# EAGLE schematic TSOC-FTDI-BASE_32 (EAGLE 6.6.0)
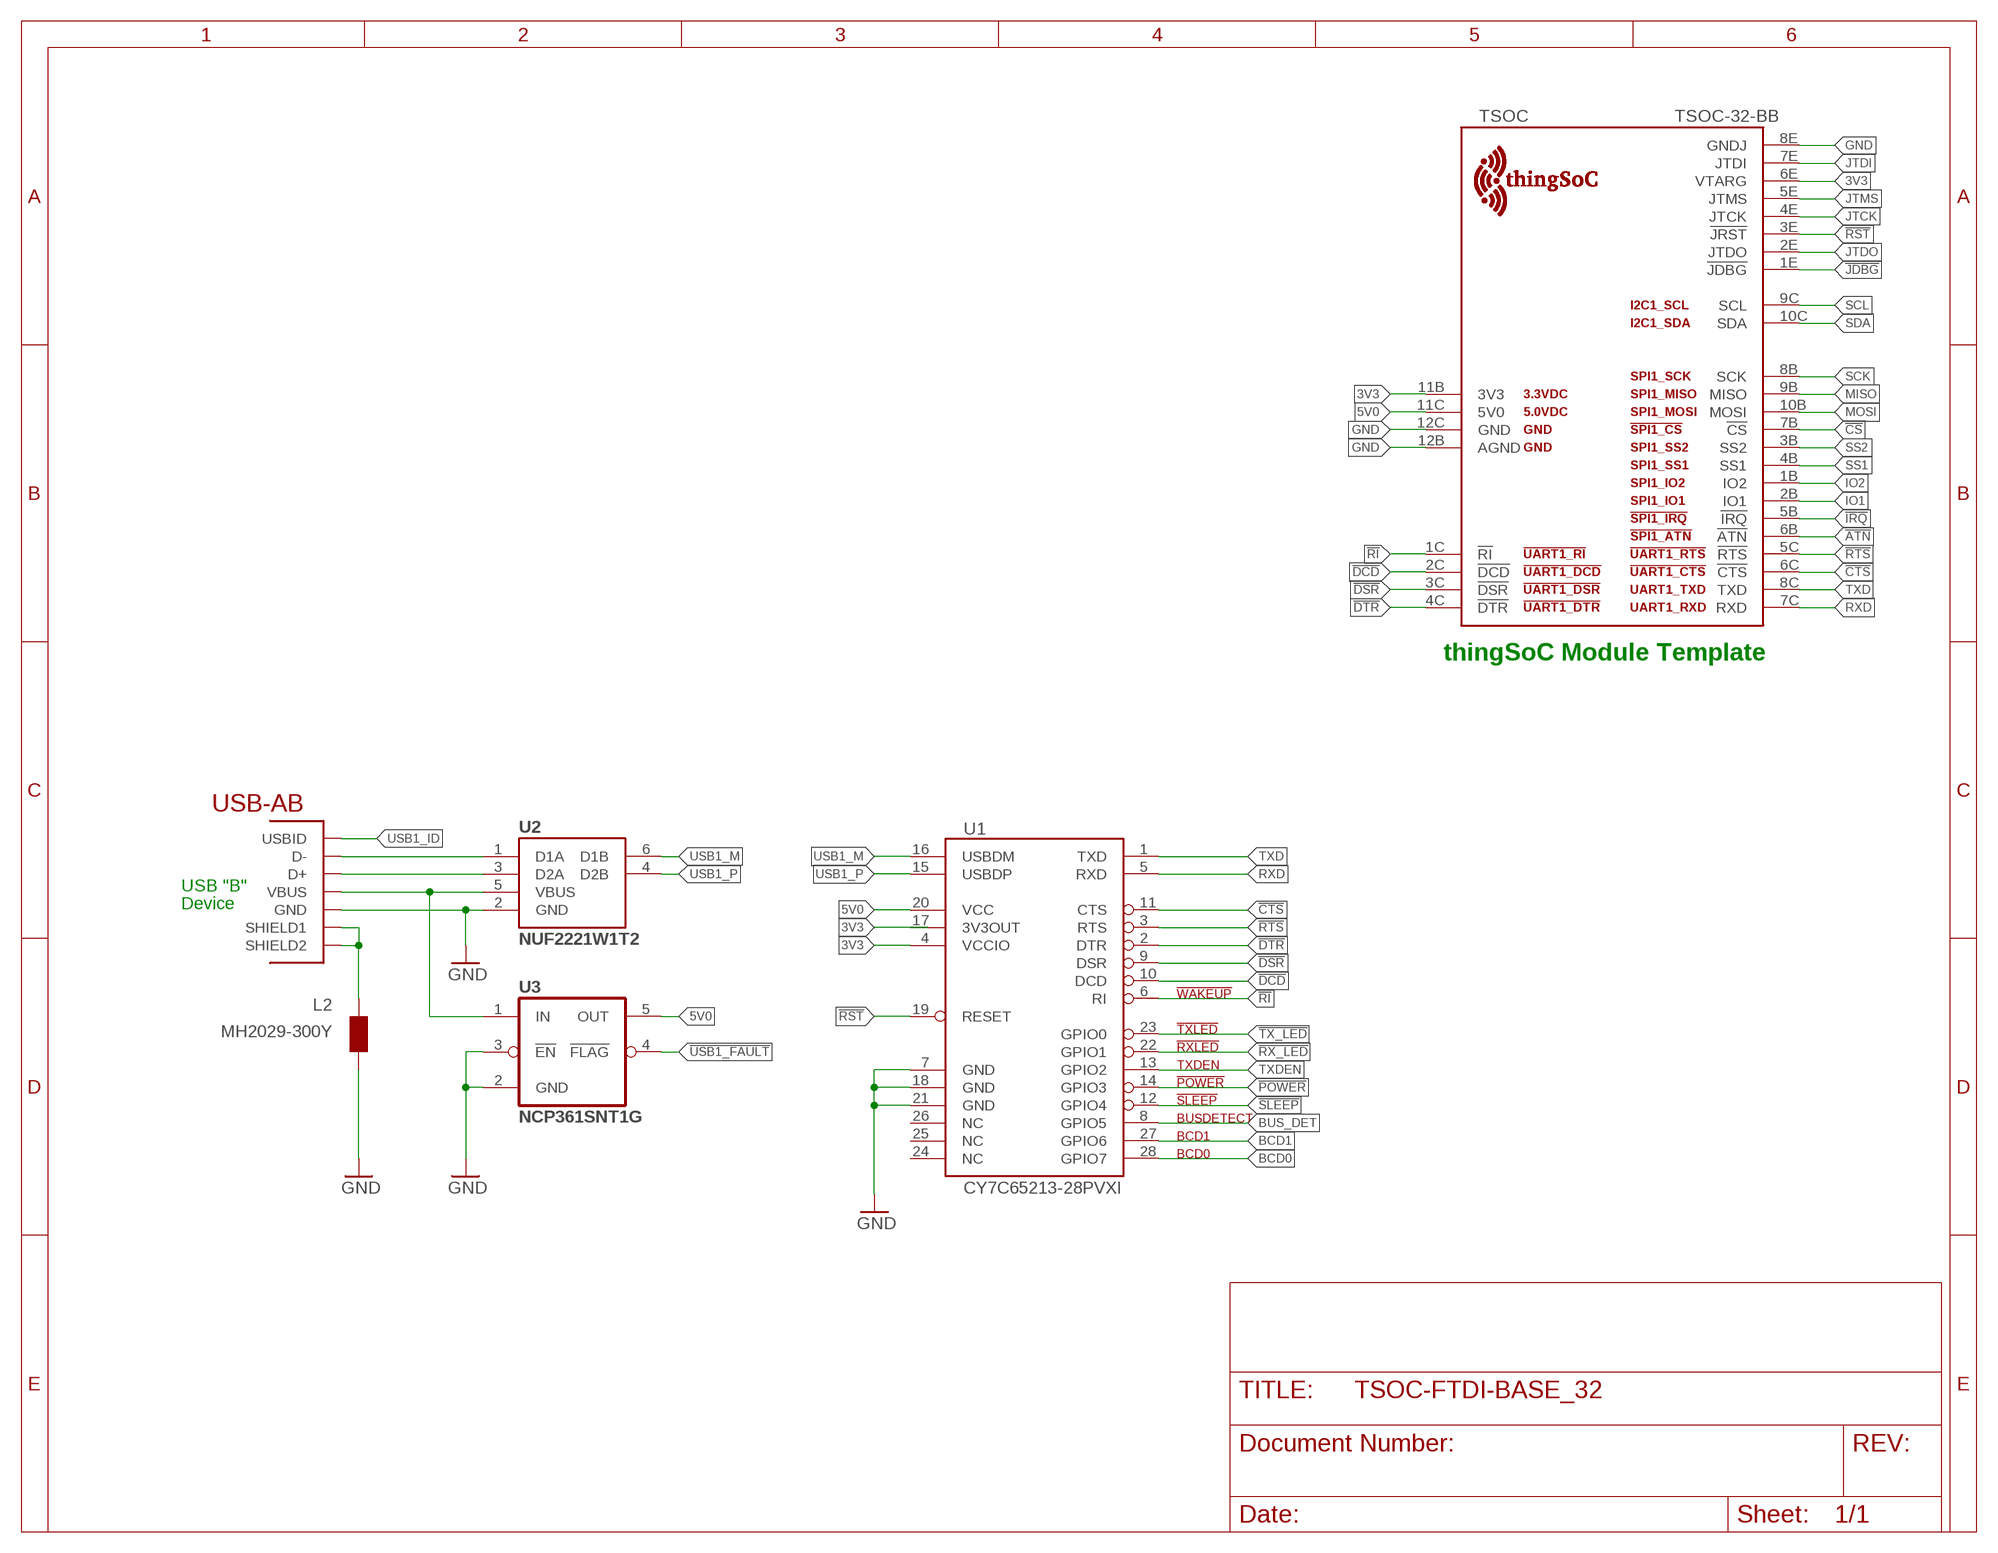
[diagram p0: schematic, sheet 1]

## Parts
L2  MH2029-300Y  WE-CBF_0805  [0805]
TSOC  TSOC-32-BB  [TSOC-BB-S32]
U1  CY7C65213-28PVXI  [SSOP28DB]
U2  NUF2221W1T2  [SOT-363]
U3  NCP361SNT1G  [SOP95P275X110-5N]
USB1  USB_AB  [USB-AB-MICRO-SMD]

## Nets
3V3: TSOC.6E(VTARG) TSOC.11B(3V3) U1.4(VCCIO)
5V0: TSOC.11C(5V0) U1.20(VCC) U3.5(OUT)
!ATN: TSOC.6B(!ATN)
!CS: TSOC.7B(!CS)
!CTS: TSOC.6C(!CTS) U1.11(CTS)
!DCD: TSOC.2C(!DCD) U1.10(DCD)
!DSR: TSOC.3C(!DSR) U1.9(DSR)
!DTR: TSOC.4C(!DTR) U1.2(DTR)
!IRQ: TSOC.5B(!IRQ)
!JDBG: TSOC.1E(!JDBG)
!POWER: U1.14(GPIO3)
!RI: TSOC.1C(!RI) U1.6(RI)
!RST: TSOC.3E(!JRST) U1.19(RESET)
!RTS: TSOC.5C(!RTS) U1.3(RTS)
!RX_LED: U1.22(GPIO1)
!SLEEP: U1.12(GPIO4)
!TX_LED: U1.23(GPIO0)
!USB1_FAULT: U3.4(!FLAG)
BCD0: U1.28(GPIO7)
BCD1: U1.27(GPIO6)
BUS_DET: U1.8(GPIO5)
GND [vcc]: L2.2 TSOC.8E(GNDJ) TSOC.12B(AGND) TSOC.12C(GND) U1.7(GND) U1.18(GND) U1.21(GND) U2.2(GND) U3.2(GND) U3.3(!EN) USB1.GND
IO1: TSOC.2B(IO1)
IO2: TSOC.1B(IO2)
JTCK: TSOC.4E(JTCK)
JTDI: TSOC.7E(JTDI)
JTDO: TSOC.2E(JTDO)
JTMS: TSOC.5E(JTMS)
MISO: TSOC.9B(MISO)
MOSI: TSOC.10B(MOSI)
RXD: TSOC.7C(RXD) U1.5(RXD)
SCK: TSOC.8B(SCK)
SCL: TSOC.9C(SCL)
SDA: TSOC.10C(SDA)
SS1: TSOC.4B(SS1)
SS2: TSOC.3B(SS2)
TXD: TSOC.8C(TXD) U1.1(TXD)
TXDEN: U1.13(GPIO2)
USB1_DM: U2.1(D1A) USB1.D-
USB1_DP: U2.3(D2A) USB1.D+
USB1_ID: USB1.ID(USBID)
USB1_M: U1.16(USBDM) U2.6(D1B)
USB1_P: U1.15(USBDP) U2.4(D2B)
USB1_SHIELD: L2.1 USB1.SHIELD1 USB1.SHIELD2
USB1_VBUS: U2.5(VBUS) U3.1(IN) USB1.VBUS
Unconnected: U1.17(3V3OUT) U1.26(NC)

## Notes on the sheet
- thingSoC Module Template
- USB "B"
- Device

## Power pins joined to a net without a drawn wire
NC: U1.24(NC) U1.25(NC)

## Library data of the parts
L2 = wuerth-elektronik:WE-CBF: SMD EMI Suppression Ferrite Beads - excellent anti-EMI properties - low DCR - impedances till 3000 ohms - rated current up to 6 A
TSOC = thingSoC:TSOC-32: thingSoC Thirty-Two (32) Pin Socket Source LBR : http://www.thingsoc.com Github : https://github.com/thingsoc License : http://creativecommons.org/licenses/by-sa/4.0/ (Creative Commons 4.0) THIS SOFTWARE IS PROVIDED BY THE CONTRIBUTORS "AS IS" AND WITHOUT ANY EXPRESS OR IMPLIED WARRANTIES, INCLUDING, BUT NOT LIMITED TO, THE IMPLIED WARRANTIES OF MERCHANTABILITY AND FITNESS FOR A PARTICULAR PURPOSE ARE DISCLAIMED. IN NO EVENT SHALL THE COPYRIGHT OWNER OR CONTRIBUTORS BE LIABLE FOR ANY DIRECT, INDIRECT, INCIDENTAL, SPECIAL, EXEMPLARY, OR CONSEQUENTIAL DAMAGES (INCLUDING, BUT NOT LIMITED TO, PROCUREMENT OF SUBSTITUTE GOODS OR SERVICES; LOSS OF USE, DATA, OR PROFITS; OR BUSINESS INTERRUPTION) HOWEVER CAUSED AND ON ANY THEORY OF LIABILITY, WHETHER IN CONTRACT, STRICT LIABILITY, OR TORT (INCLUDING NEGLIGENCE OR OTHERWISE) ARISING IN ANY WAY OUT OF THE USE OF THIS SOFTWARE, EVEN IF ADVISED OF THE POSSIBILITY OF SUCH DAMAGE.
U1 = PatternAgents-Cypress:CY7C65213-28: Cypress EZ-USB ® CY7C65213-28SSOP USB TO UART BRIDGE Full-Speed USB Peripheral Controller Source Data: http://www.cypress.com/?mpn=CY7C65213-28xxxx LBR Source: http://www.patternagents.com THIS SOFTWARE IS PROVIDED BY THE CONTRIBUTORS "AS IS" AND WITHOUT ANY EXPRESS OR IMPLIED WARRANTIES, INCLUDING, BUT NOT LIMITED TO, THE IMPLIED WARRANTIES OF MERCHANTABILITY AND FITNESS FOR A PARTICULAR PURPOSE ARE DISCLAIMED. IN NO EVENT SHALL THE COPYRIGHT OWNER OR CONTRIBUTORS BE LIABLE FOR ANY DIRECT, INDIRECT, INCIDENTAL, SPECIAL, EXEMPLARY, OR CONSEQUENTIAL DAMAGES (INCLUDING, BUT NOT LIMITED TO, PROCUREMENT OF SUBSTITUTE GOODS OR SERVICES; LOSS OF USE, DATA, OR PROFITS; OR BUSINESS INTERRUPTION) HOWEVER CAUSED AND ON ANY THEORY OF LIABILITY, WHETHER IN CONTRACT, STRICT LIABILITY, OR TORT (INCLUDING NEGLIGENCE OR OTHERWISE) ARISING IN ANY WAY OUT OF THE USE OF THIS SOFTWARE, EVEN IF ADVISED OF THE POSSIBILITY OF SUCH DAMAGE.
U2 = PatternAgents-OnSemi:NUF2221W1T2: NUF2221W1T2 USB ESD Protection, EMI FIlter, and Line Termination
U3 = PatternAgents-OnSemi:NCP361SNT1G: USB Positive Overvoltage Protection Controller; MPN: NCP361SNT1G; OC_FARNELL: 1642242; OC_NEWARK: 01P0135; PACKAGE: TSOP-5; SUPPLIER: ON Semiconductor
USB1 = BeeSafe:USB_AB: This is a USB AB connector that is compatible with USB OTG. i.e. this connector can serve as a host or device

## Net classes
1 vcc: width 0.254 mm